# Altium project lan9252.PrjPcb
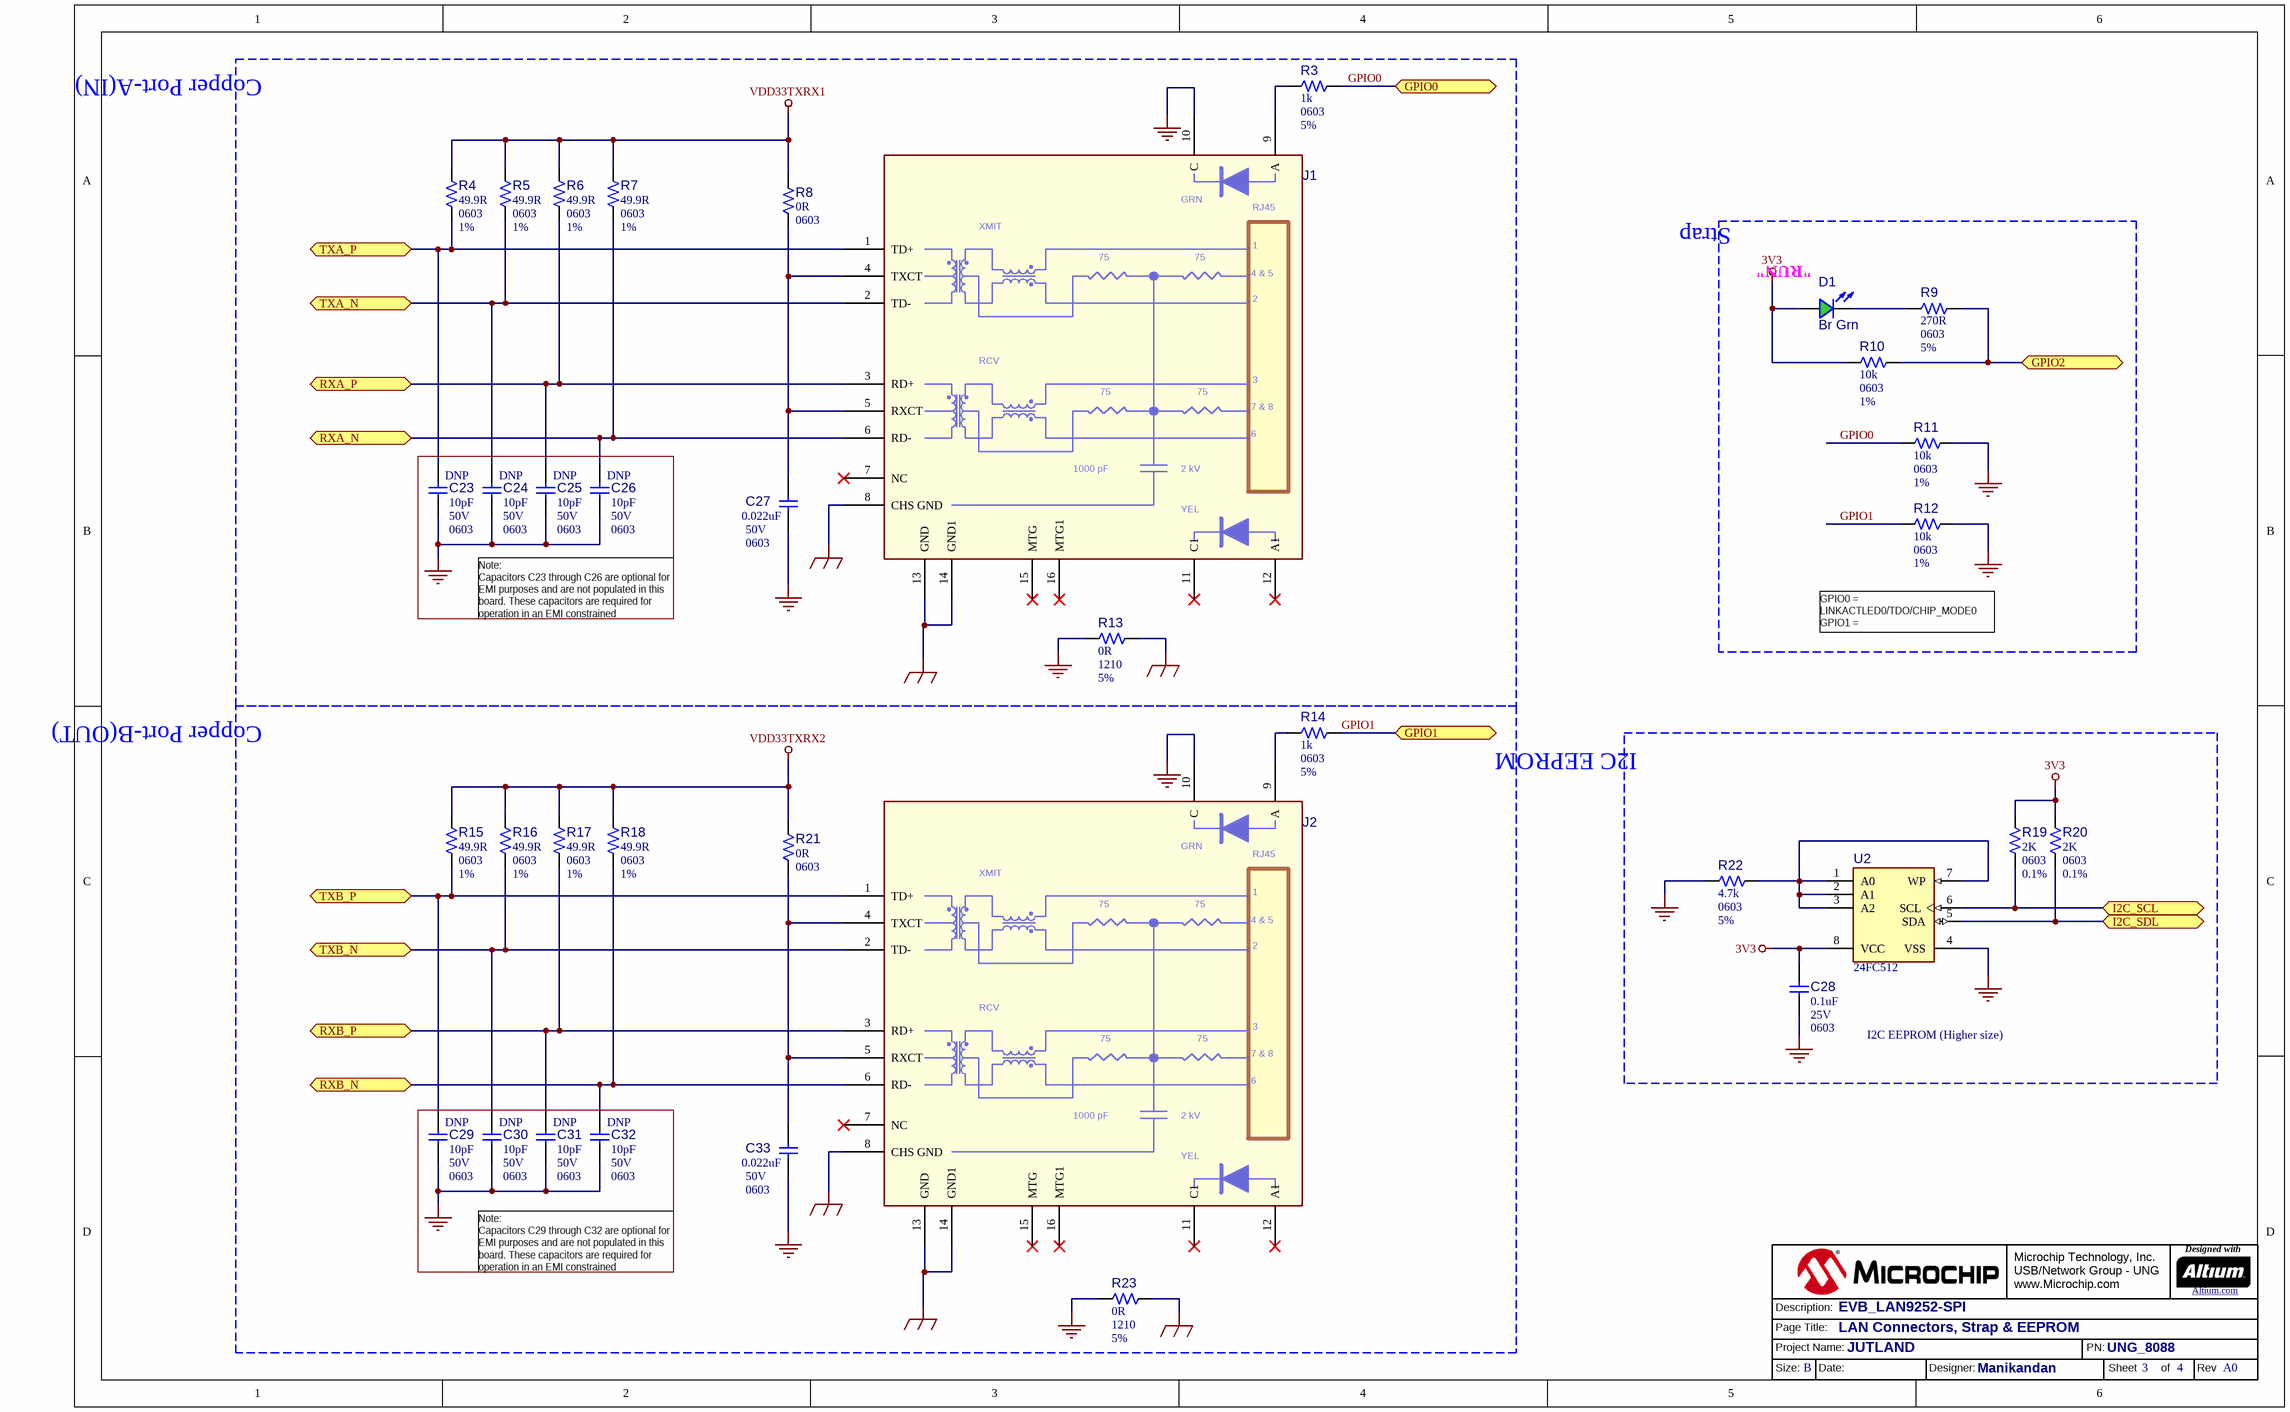
[diagram p0: UNG_8088_EVB_LAN9252-SPI_Copper.SchDoc]
3 sheets, 86 parts. Net scope: flat (ports and power ports of the same name join across sheets).
Board file: UNG_8088_EVB_LAN9252-SPI.PcbDoc
Sheets:
  UNG_8088_EVB_LAN9252-SPI_Copper.SchDoc
  UNG_8088_EVB_LAN9252-SPI_LAN9252-1.SchDoc
  UNG_8088_EVB_LAN9252-SPI_LAN9252-2.SchDoc

## Sheet UNG_8088_EVB_LAN9252-SPI_Copper.SchDoc
size 416 x 264 mm; Revision: A0; SheetNumber: 3; SheetTotal: 4; PageSetup: Record=PageOptions|CenterHorizontal=True|CenterVertical=True|PrintScale=1.02|XCorrection=1.00|YCorrection=1.00|PrintKind=0|BorderSize=5000000|LeftOffset=0|BottomOffset=0|Orientation=2|PaperLength=1000|PaperWidth=1000|Scale=100|PaperSource=15|PrintQuality=-3|MediaType=1|DitherType=10|PrintScaleMode=1|PaperKind=11 x 17|PaperIndex=119; SheetTitle: Change Log; PageTitle: LAN Connectors, Strap & EEPROM; ProjName: JUTLAND; DesignDescription: EVB_LAN9252-SPI; Designer: Manikandan; PartNumber: UNG_8088; DocumentFullPathAndName: //depot_np_hweng_boards/ung_hweng/UNG_8088_FDB_LAN9252-ADD-ON-forF28379D/

### Parts
(Parts that share a designator on the sheet are numbered #1, #2 ... from top to bottom, then left to right.)
?#1  (no value)  (graphical)
C23  value 10pF  Voltage: 50V  Package: 0603  Populated: DNP  [CAP_C_0603]  (hidden comment: Capacitor NP)
C24  value 10pF  Voltage: 50V  Package: 0603  Populated: DNP  [CAP_C_0603]  (hidden comment: Capacitor NP)
C25  value 10pF  Voltage: 50V  Package: 0603  Populated: DNP  [CAP_C_0603]  (hidden comment: Capacitor NP)
C26  value 10pF  Voltage: 50V  Package: 0603  Populated: DNP  [CAP_C_0603]  (hidden comment: Capacitor NP)
C27  value 0.022uF  Voltage: 50V  Package: 0603  [CAP_C_0603]  (hidden comment: Capacitor NP)
C28  value 0.1uF  Voltage: 25V  Package: 0603  [CAP_C_0603]  (hidden comment: Capacitor NP)
C29  value 10pF  Voltage: 50V  Package: 0603  Populated: DNP  [CAP_C_0603]  (hidden comment: Capacitor NP)
C30  value 10pF  Voltage: 50V  Package: 0603  Populated: DNP  [CAP_C_0603]  (hidden comment: Capacitor NP)
C31  value 10pF  Voltage: 50V  Package: 0603  Populated: DNP  [CAP_C_0603]  (hidden comment: Capacitor NP)
C32  value 10pF  Voltage: 50V  Package: 0603  Populated: DNP  [CAP_C_0603]  (hidden comment: Capacitor NP)
C33  value 0.022uF  Voltage: 50V  Package: 0603  [CAP_C_0603]  (hidden comment: Capacitor NP)
D1  value Br Grn  [LED_0603_GREEN]  (hidden comment: LED, Bright Green, 0603)
J1  CONN RJ45 J0011D01BNL  [RJ45_J0011D01BNL]  (value not drawn)
J2  CONN RJ45 J0011D01BNL  [RJ45_J0011D01BNL]  (value not drawn)
R3  value 1k  Package: 0603  Tolerance: 5%  [RES_C_0603]  (hidden comment: Resistor)
R4  value 49.9R  Package: 0603  Tolerance: 1%  [RES_C_0603]  (hidden comment: Resistor)
R5  value 49.9R  Package: 0603  Tolerance: 1%  [RES_C_0603]  (hidden comment: Resistor)
R6  value 49.9R  Package: 0603  Tolerance: 1%  [RES_C_0603]  (hidden comment: Resistor)
R7  value 49.9R  Package: 0603  Tolerance: 1%  [RES_C_0603]  (hidden comment: Resistor)
R8  value 0R  Package: 0603  [RES_C_0603]  (hidden comment: Resistor)
R9  value 270R  Package: 0603  Tolerance: 5%  [RES_C_0603]  (hidden comment: Resistor)
R10  value 10k  Package: 0603  Tolerance: 1%  [RES_C_0603]  (hidden comment: Resistor)
R11  value 10k  Package: 0603  Tolerance: 1%  [RES_C_0603]  (hidden comment: Resistor)
R12  value 10k  Package: 0603  Tolerance: 1%  [RES_C_0603]  (hidden comment: Resistor)
R13  value 0R  Package: 1210  Tolerance: 5%  [RES_C_1210]  (hidden comment: Resistor)
R14  value 1k  Package: 0603  Tolerance: 5%  [RES_C_0603]  (hidden comment: Resistor)
R15  value 49.9R  Package: 0603  Tolerance: 1%  [RES_C_0603]  (hidden comment: Resistor)
R16  value 49.9R  Package: 0603  Tolerance: 1%  [RES_C_0603]  (hidden comment: Resistor)
R17  value 49.9R  Package: 0603  Tolerance: 1%  [RES_C_0603]  (hidden comment: Resistor)
R18  value 49.9R  Package: 0603  Tolerance: 1%  [RES_C_0603]  (hidden comment: Resistor)
R19  value 2K  Package: 0603  Tolerance: 0.1%  [RES_C_0603]  (hidden comment: Resistor)
R20  value 2K  Package: 0603  Tolerance: 0.1%  [RES_C_0603]  (hidden comment: Resistor)
R21  value 0R  Package: 0603  [RES_C_0603]  (hidden comment: Resistor)
R22  value 4.7k  Package: 0603  Tolerance: 5%  [RES_C_0603]  (hidden comment: Resistor)
R23  value 0R  Package: 1210  Tolerance: 5%  [RES_C_1210]  (hidden comment: Resistor)
U2  24FC512  [SOIC-8]

### Blocks framed on the sheet
Copper Port-A(IN): C23-C27 J1 R3-R8 R13
Strap: D1 R9-R12
Copper Port-B(OUT): C29-C33 J2 R14-R18 R21 R23
I2C EEPROM: C28 R19 R20 R22 U2

### Ports
GPIO0 (bidir), GPIO1 (bidir), GPIO2 (bidir), I2C_SCL (bidir), I2C_SDL (bidir), RXA_N (bidir), RXA_P (bidir), RXB_N (bidir), RXB_P (bidir), TXA_N (bidir), TXA_P (bidir), TXB_N (bidir), TXB_P (bidir)

### Nets
3V3: C28.2 D1.1(A) R10.2 R19.2 R20.2 U2.8(VCC)
Earth1: J1.8(CHS_GND) J1.13(GND) J1.14(GND1) R13.2
Earth2: J2.8(CHS_GND) J2.13(GND) J2.14(GND1) R23.2
GND: C23.1 C24.1 C25.1 C26.1 C27.1 C28.1 C29.1 C30.1 C31.1 C32.1 C33.1 J1.10(C) J2.10(C) R11.1 R12.1 R13.1 R22.1 R23.1 U2.4(VSS)
VDD33TXRX1: R4.2 R5.2 R6.2 R7.2 R8.2
VDD33TXRX2: R15.2 R16.2 R17.2 R18.2 R21.2
GPIO0: R3.2 R11.2 ; port GPIO0
GPIO1: R12.2 R14.2 ; port GPIO1
NetC23_2: C23.2 J1.1(TD+) R4.1 ; port TXA_P
NetC24_2: C24.2 J1.2(TD-) R5.1 ; port TXA_N
NetC25_2: C25.2 J1.3(RD+) R6.1 ; port RXA_P
NetC26_2: C26.2 J1.6(RD-) R7.1 ; port RXA_N
NetC27_2: C27.2 J1.4(TXCT) J1.5(RXCT) R8.1
NetC29_2: C29.2 J2.1(TD+) R15.1 ; port TXB_P
NetC30_2: C30.2 J2.2(TD-) R16.1 ; port TXB_N
NetC31_2: C31.2 J2.3(RD+) R17.1 ; port RXB_P
NetC32_2: C32.2 J2.6(RD-) R18.1 ; port RXB_N
NetC33_2: C33.2 J2.4(TXCT) J2.5(RXCT) R21.1
NetD1_2: D1.2(K) R9.2
NetJ1_9: J1.9(A) R3.1
NetJ2_9: J2.9(A) R14.1
NetR9_1: R9.1 R10.1 ; port GPIO2
NetR19_1: R19.1 U2.6(SCL) ; port I2C_SCL
NetR20_1: R20.1 U2.5(SDA) ; port I2C_SDL
NetR22_2: R22.2 U2.1(A0) U2.2(A1) U2.3(A2) U2.7(WP)

Not connected (* = marked no-connect by the designer): J1 7(NC)* 11(C1)* 12(A1)* 15(MTG)* 16(MTG1)*; J2 7(NC)* 11(C1)* 12(A1)* 15(MTG)* 16(MTG1)*

### Notes on the sheet
- (near D1) "RUN"
- Note:
  Capacitors C23 through C26 are optional for EMI purposes and are not populated in this  board. These capacitors are required for operation in an EMI constrained environment.
- GPIO0 = LINKACTLED0/TDO/CHIP_MODE0
  GPIO1 = LINKACTLED1/TDI/CHIP_MODE1
  GPIO2 = RUNLED/E2PSIZE
- I2C EEPROM (Higher size)
- Note:
  Capacitors C29 through C32 are optional for EMI purposes and are not populated in this  board. These capacitors are required for operation in an EMI constrained environment.
- Microchip Technology, Inc.
  USB/Network Group - UNG
  www.Microchip.com
- Designed with
- Altium.com <http://go.altium.com/MicrochipLandingPage_Evaluation.html>
- Page Title:
- Project Name:
- Description:
- PN:
- Size:
- B
- Date:
- Designer:
- Sheet
- of
- Rev
- (in symbol CONN RJ45 TH PULSE J0011D01BNL) GRN; XMIT; 75; 4 & 5; RCV; 7 & 8; 1000 pF; 2 kV; YEL

### Library data of the parts
?#1 = Title Block B_UNG1_Altium
C23-C26 C29-C32 = CAP0142: Capacitor; Manufacturer 1: KEMET; Manufacturer Part Number 1: C0603C100J5GAC; Description_: CAP CER 10pF 50V 5% NP0 SMD 0603; Tolerance: 5%; Temperature Coeffcient: NP0; Type: Ceramic; MCHP-ID: CAP0142; Revision: 1; Status: Production; ComponentLink1URL: https://chn-vm-apps.microchip.com/mchprepo/parts/Datasheets/KEM_C1002_X7R_SMD.pdf; ComponentLink1Description: Datasheet; Operating Temperature: -55C to +125C; Category: Capacitor; Manufacturer 2: KEMET; Manufacturer Part Number 2: C0603C100J5GACTU; Manufacturer 3: TDK; Manufacturer Part Number 3: C1608C0G1H100J; Manufacturer 4: Murata; Manufacturer Part Number 4: GRM1885C1H100JA01D; Supplier 1: KEMET; Supplier Part Number 1: C0603C100J5GAC; Supplier 2: Digi-Key; Supplier Part Number 2: 399-1049-2-ND; Supplier 3: Digi-Key; Supplier Part Number 3: 445-6852-1-ND; Supplier 4: Digi-Key; Supplier Part Number 4: 490-1403-2-ND; Supplier 5: Digi-Key; Supplier Part Number 5: 490-1403-1-ND; Quantity Override: 1
C27 C33 = CAP0625: Capacitor; Manufacturer 1: AVX; Manufacturer Part Number 1: 06035C223JAT2A; Description_: CAP CER 0.022uF 50V 5% X7R SMD 0603; Tolerance: 5%; Temperature Coeffcient: X7R; Type: Ceramic; Populated: YES; MCHP-ID: CAP0625; Revision: 1; Status: Production; ComponentLink1URL: https://chn-vm-apps.microchip.com/mchprepo/parts/Datasheets/smccp.pdf; ComponentLink1Description: Datasheet; Operating Temperature: -55C to +125C; Category: Capacitor; Supplier 1: Digi-Key; Supplier Part Number 1: 478-3722-2-ND; Quantity Override: 1
C28 = CAP0012: Capacitor; Manufacturer 1: Cal-Chip; Manufacturer Part Number 1: GMC10Y5V104Z25NTLF; Description_: CAP CER 0.1uF 25V 20% Y5V SMD 0603; Tolerance: 20%; Temperature Coeffcient: Y5V; Type: Ceramic; Populated: Yes; MCHP-ID: CAP0012; Revision: 1; Status: Production; ComponentLink1URL: https://chn-vm-apps.microchip.com/mchprepo/parts/Datasheets/nmc2.pdf; ComponentLink1Description: Datasheet; Operating Temperature: -30C to + 85C; Category: Capacitor; Manufacturer 2: NIC Components; Manufacturer Part Number 2: NMC0603Y5V104Z25TRPF; Manufacturer 3: Panasonic; Manufacturer Part Number 3: ECJ-1VF1E104Z; Manufacturer 4: ROHM; Manufacturer Part Number 4: MCH182FN104ZK; Manufacturer 5: Murata; Manufacturer Part Number 5: GRM188F51E104ZA01D; Supplier 1: Cal-Chip; Supplier Part Number 1: GMC10Y5V104Z25NTLF; Supplier 2: NIC Components; Supplier Part Number 2: NMC0603Y5V104Z25TRPF; Supplier 3: Digi-Key; Supplier Part Number 3: PCC1794TR-ND; Supplier 4: ROHM; Supplier Part Number 4: MCH182FN104ZK; Supplier 5: Raynen; Supplier Part Number 5: 490-1575-1-ND; Quantity Override: 1
D1 = LED, Bright Green, 0603: Manufacturer 1: Lite-On; Manufacturer Part Number 1: LTST-C191KGKT; Type: LED Single; Forward Current: 20mA; MCD: 35mcd; Owner: Jennifer Hancock; Viewing Angle: 130°; Revision: -; Description_: LED, Bright Green, 0603; Package: 0603 (1608 Metric); ComponentLink1URL: http://optoelectronics.liteon.com/upload/download/DS22-2000-228/S_110_LTST-C191KGKT.pdf; ComponentLink1Description: Datasheet; Category: Diode; Mounting Type: Surface Mount; Supplier 1: Digi-Key; Supplier Part Number 1: 160-1446-6-ND
J1 J2 = CONN RJ45 TH PULSE J0011D01BNL: Owner: Manikandan; Populated: YES; Description_: CONN RJ45 TH PULSE J0011D01BNL; ComponentLink1URL: http://www.digikey.com/product-search/en?keywords=J0011D01BNL; ComponentLink1Description: Datasheet; Package: RJ45; Type: Connector; Category: Interconnects; Manufacturer 1: Pulse; Manufacturer Part Number 1: J0011D01BNL; Supplier 1: Digi-Key; Supplier Part Number 1: 553-1483-ND; ROHS: Yes
R3 R14 = RES1128: Manufacturer 1: Panasonic; Manufacturer Part Number 1: ERJ-3GEYJ102V; Description_: RES TKF 1k 5% 1/10W SMD 0603; Voltage: 75V; Temperature Coeffcient: 200ppm/C; Power: 1/10W; Owner: Bogdan P (M91398); Populated: Yes; MCHP-ID: RES1128; Revision: 0; Status: Production; ComponentLink1URL: https://chn-vm-apps.microchip.com/mchprepo/parts/Datasheets/AOA0000CE1.pdf; ComponentLink1Description: Datasheet; Operating Temperature: -55C to +155C; Category: Resistor; Type: RES SMD; Composition: TKF; Supplier 1: Digi-Key; Supplier Part Number 1: P1.0KGCT-ND; Quantity Override: 1
R4-R7 R15-R18 = RES1188: Manufacturer 1: Panasonic; Manufacturer Part Number 1: ERJ-3EKF49R9V; Description_: RES TKF 49.9R 1% 1/10W SMD 0603; Voltage: 75V; Temperature Coeffcient: 100ppm/C; Power: 1/10W; Owner: Adrian T (M91397); Populated: Yes; MCHP-ID: RES1188; Revision: 0; Status: Production; ComponentLink1URL: https://chn-vm-apps.microchip.com/mchprepo/parts/Datasheets/AOA0000CE2.pdf; ComponentLink1Description: Datasheet; Operating Temperature: -55C to +155C; Category: Resistor; Type: RES SMD; Composition: TKF; Supplier 1: Digi-Key; Supplier Part Number 1: P49.9HCT-ND; Quantity Override: 1
R8 R21 = RSMT0001: Manufacturer 1: NIC Components; Manufacturer Part Number 1: NRC06Z0TRF; Description_: RES TKF 0R 1/10W SMD 0603; Power: 1/10W; Populated: Yes; MCHP-ID: RSMT0001; Revision: 2; Status: Production; ComponentLink1URL: https://chn-vm-apps.microchip.com/mchprepo/parts/Datasheets/nrc.pdf; ComponentLink1Description: Datasheet; Operating Temperature: -55C to +155C; Category: Resistor; Type: RES SMD; Composition: TKF; Manufacturer 2: Panasonic; Manufacturer Part Number 2: ERJ-3GSY0R00V; Manufacturer 3: Panasonic; Manufacturer Part Number 3: ERJ-3GEY0R00V; Manufacturer 4: Stackpole Electronics Inc; Manufacturer Part Number 4: RMCF0603ZT0R00; Manufacturer 5: Vishay; Manufacturer Part Number 5: CRCW06030000Z0EA; Manufacturer 6: Stackpole Electronics Inc; Manufacturer Part Number 6: RMCF 1/16 0 R; Manufacturer 7: Yageo; Manufacturer Part Number 7: RC0603JR-070RL; Manufacturer 8: KOA Speer; Manufacturer Part Number 8: RK73Z1JTTP; Manufacturer 9: ROHM; Manufacturer Part Number 9: MCR03EZPJ000; Supplier 1: NIC Components; Supplier Part Number 1: NRC06Z0TRF; Supplier 2: Digi-Key; Supplier Part Number 2: P0.0GTR-ND; Supplier 3: Digi-Key; Supplier Part Number 3: RMCF0603ZT0R00TR-ND; Supplier 4: Digi-Key; Supplier Part Number 4: RMCF0603ZT0R00CT-ND; Supplier 5: Digi-Key; Supplier Part Number 5: 541-0.0GCT-ND; Supplier 6: Digi-Key; Supplier Part Number 6: RMCF1/160RTR-ND; Supplier 7: Digi-Key; Supplier Part Number 7: 311-0.0GRCT-ND; Supplier 8: KOA Speer; Supplier Part Number 8: RK73Z1JTTP; Supplier 9: Digi-Key; Supplier Part Number 9: RHM0.0GCT-ND; Quantity Override: 1
R9 = RES1150: Manufacturer 1: Panasonic; Manufacturer Part Number 1: ERJ-3GEYJ271V; Description_: RES TKF 270R 5% 1/10W SMD 0603; Dev Tools Status: Production; Voltage: 75V; Temperature Coeffcient: 200ppm/C; Power: 1/10W; Owner: Bogdan P (M91398); Populated: Yes; MCHP-ID: RES1150; Revision: 0; Status: MCL Design; ComponentLink1URL: https://chn-vm-apps.microchip.com/mchprepo/parts/Datasheets/AOA0000CE1.pdf; ComponentLink1Description: Datasheet; Operating Temperature: -55C to +155C; Category: Resistor; Type: RES SMD; Composition: TKF; Supplier 1: Digi-Key; Supplier Part Number 1: P270GCT-ND; Quantity Override: 1
R10-R12 = RES1368: Manufacturer 1: TE Connectivity; Manufacturer Part Number 1: 5-1879337-9; Description_: RES TF 10k 1% 1/16W SMD 0603; Voltage: 100V; Temperature Coeffcient: 50ppm/C; Circuit Type: Isolated; Power: 1/16W; Owner: Jairuz Agang-ang; Populated: YES; MCHP-ID: RES1368; Revision: 1; Status: Production; ComponentLink1URL: https://chn-vm-apps.microchip.com/mchprepo/parts/Datasheets/ENG_DS_1773200_H.pdf; ComponentLink1Description: Datasheet; Operating Temperature: -55C to +155C; Category: Resistor; Type: RES SMD; Composition: TF; Supplier 1: Digi-Key; Supplier Part Number 1: A102203CT-ND; Quantity Override: 1
R13 R23 = RSMT0610: Manufacturer 1: Vishay; Manufacturer Part Number 1: CRCW12100000Z0EA; Description_: RES TKF 0R 1/3W SMD 1210; Power: 1/3W; Populated: Yes; MCHP-ID: RSMT0610; Revision: 1; Status: Production; ComponentLink1URL: https://chn-vm-apps.microchip.com/mchprepo/parts/Datasheets/dcrcwe3.pdf; ComponentLink1Description: Datasheet; Operating Temperature: -55C to +155C; Category: Resistor; Type: RES SMD; Composition: TKF; Supplier 1: Digi-Key; Supplier Part Number 1: 541-0.0VCT-ND; Quantity Override: 1
R19 R20 = RES1693: Manufacturer 1: Yageo; Manufacturer Part Number 1: RT0603BRD072KL; Description_: RES SMD 2K OHM 0.1% 1/10W 0603; Dev Tools Status: Design; Temperature Coeffcient: ±25ppm/°C; Power: 0.1W, 1/10W; Owner: Jose Garcia; Populated: YES; MCHP-ID: RES1693; Revision: 1; Symbol: Resistor; Status: MCL Design; ComponentLink1Description: Datasheet; Operating Temperature: -55°C ~ 155°C; Category: Resistor; Type: RES SMD; Composition: TF; Supplier 1: Digi-Key; Supplier Part Number 1: YAG1626CT-ND; Quantity Override: 1
R22 = RES1178: Manufacturer 1: Panasonic; Manufacturer Part Number 1: ERJ-3GEYJ472V; Description_: RES TKF 4.7k 5% 1/10W SMD 0603; Dev Tools Status: Production; Voltage: 75V; Temperature Coeffcient: 200ppm/C; Power: 1/10W; Owner: Bogdan P (M91398); Populated: Yes; MCHP-ID: RES1178; Revision: 0; Symbol: Resistor; Status: MCL Design; ComponentLink1URL: https://chn-vm-apps.microchip.com/mchprepo/parts/Datasheets/AOA0000CE1.pdf; ComponentLink1Description: Datasheet; Operating Temperature: -55C to +155C; Category: Resistor; Type: RES SMD; Composition: TKF; Supplier 1: Digi-Key; Supplier Part Number 1: P4.7KGCT-ND; Quantity Override: 1
U2 = 24FC512: EEPROM I2C; Manufacturer 1: Microchip; Manufacturer Part Number 1: 24FC512T-I/SN; Description_: MCHP MEMORY SERIAL EEPROM 512k I2C 24FC512-I/SN SOIC-8; Symobl: 24XXXX SOIC-8; MAPS Description: 512K, 64K X 8 2.5V SERIAL EE, IND; Dev Tools Status: Production; PackingMedia: T/R; TempRange: -40C to +85C; LeadCount: 8; PackageWidth: 3.90mm(.150in); LeadContent: Pb-FREE; MemorySizeNum: 512000; OpVoltMin: 2.5; OpVoltMax: 5.5; MaxClockFreq: 400 kHz; AddressPins: 3; WPScheme: Full Array; MemoryOrg: x8; Populated: Yes; Type: Serial EEPROM; Category: MCHP-Memory; ComponentLink1URL: http://www.microchip.com/wwwproducts/en/24FC512; ComponentLink1Description: Datasheet; Manufacturer 2: Microchip; Manufacturer Part Number 2: 24FC512-I/SN; Supplier 1: Microchip; Supplier Part Number 1: 24FC512T-I/SN; Supplier 2: Microchip; Supplier Part Number 2: 24FC512-I/SN; PackageType: SOIC; Quantity Override: 1; Value: 24FC512

## Sheet UNG_8088_EVB_LAN9252-SPI_LAN9252-1.SchDoc
size 416 x 264 mm; Revision: A0; SheetNumber: 2; SheetTotal: 4; PageSetup: Record=PageOptions|CenterHorizontal=True|CenterVertical=True|PrintScale=1.02|XCorrection=1.00|YCorrection=1.00|PrintKind=0|BorderSize=5000000|LeftOffset=0|BottomOffset=0|Orientation=2|PaperLength=1000|PaperWidth=1000|Scale=100|PaperSource=15|PrintQuality=-3|MediaType=1|DitherType=10|PrintScaleMode=1|PaperKind=11 x 17|PaperIndex=119; SheetTitle: Change Log; PageTitle: LAN9252-1; ProjName: JUTLAND; DesignDescription: EVB_LAN9252-SPI; Designer: Manikandan; PartNumber: UNG_8088; DocumentFullPathAndName: //depot_np_hweng_boards/ung_hweng/UNG_8088_FDB_LAN9252-ADD-ON-forF28379D/
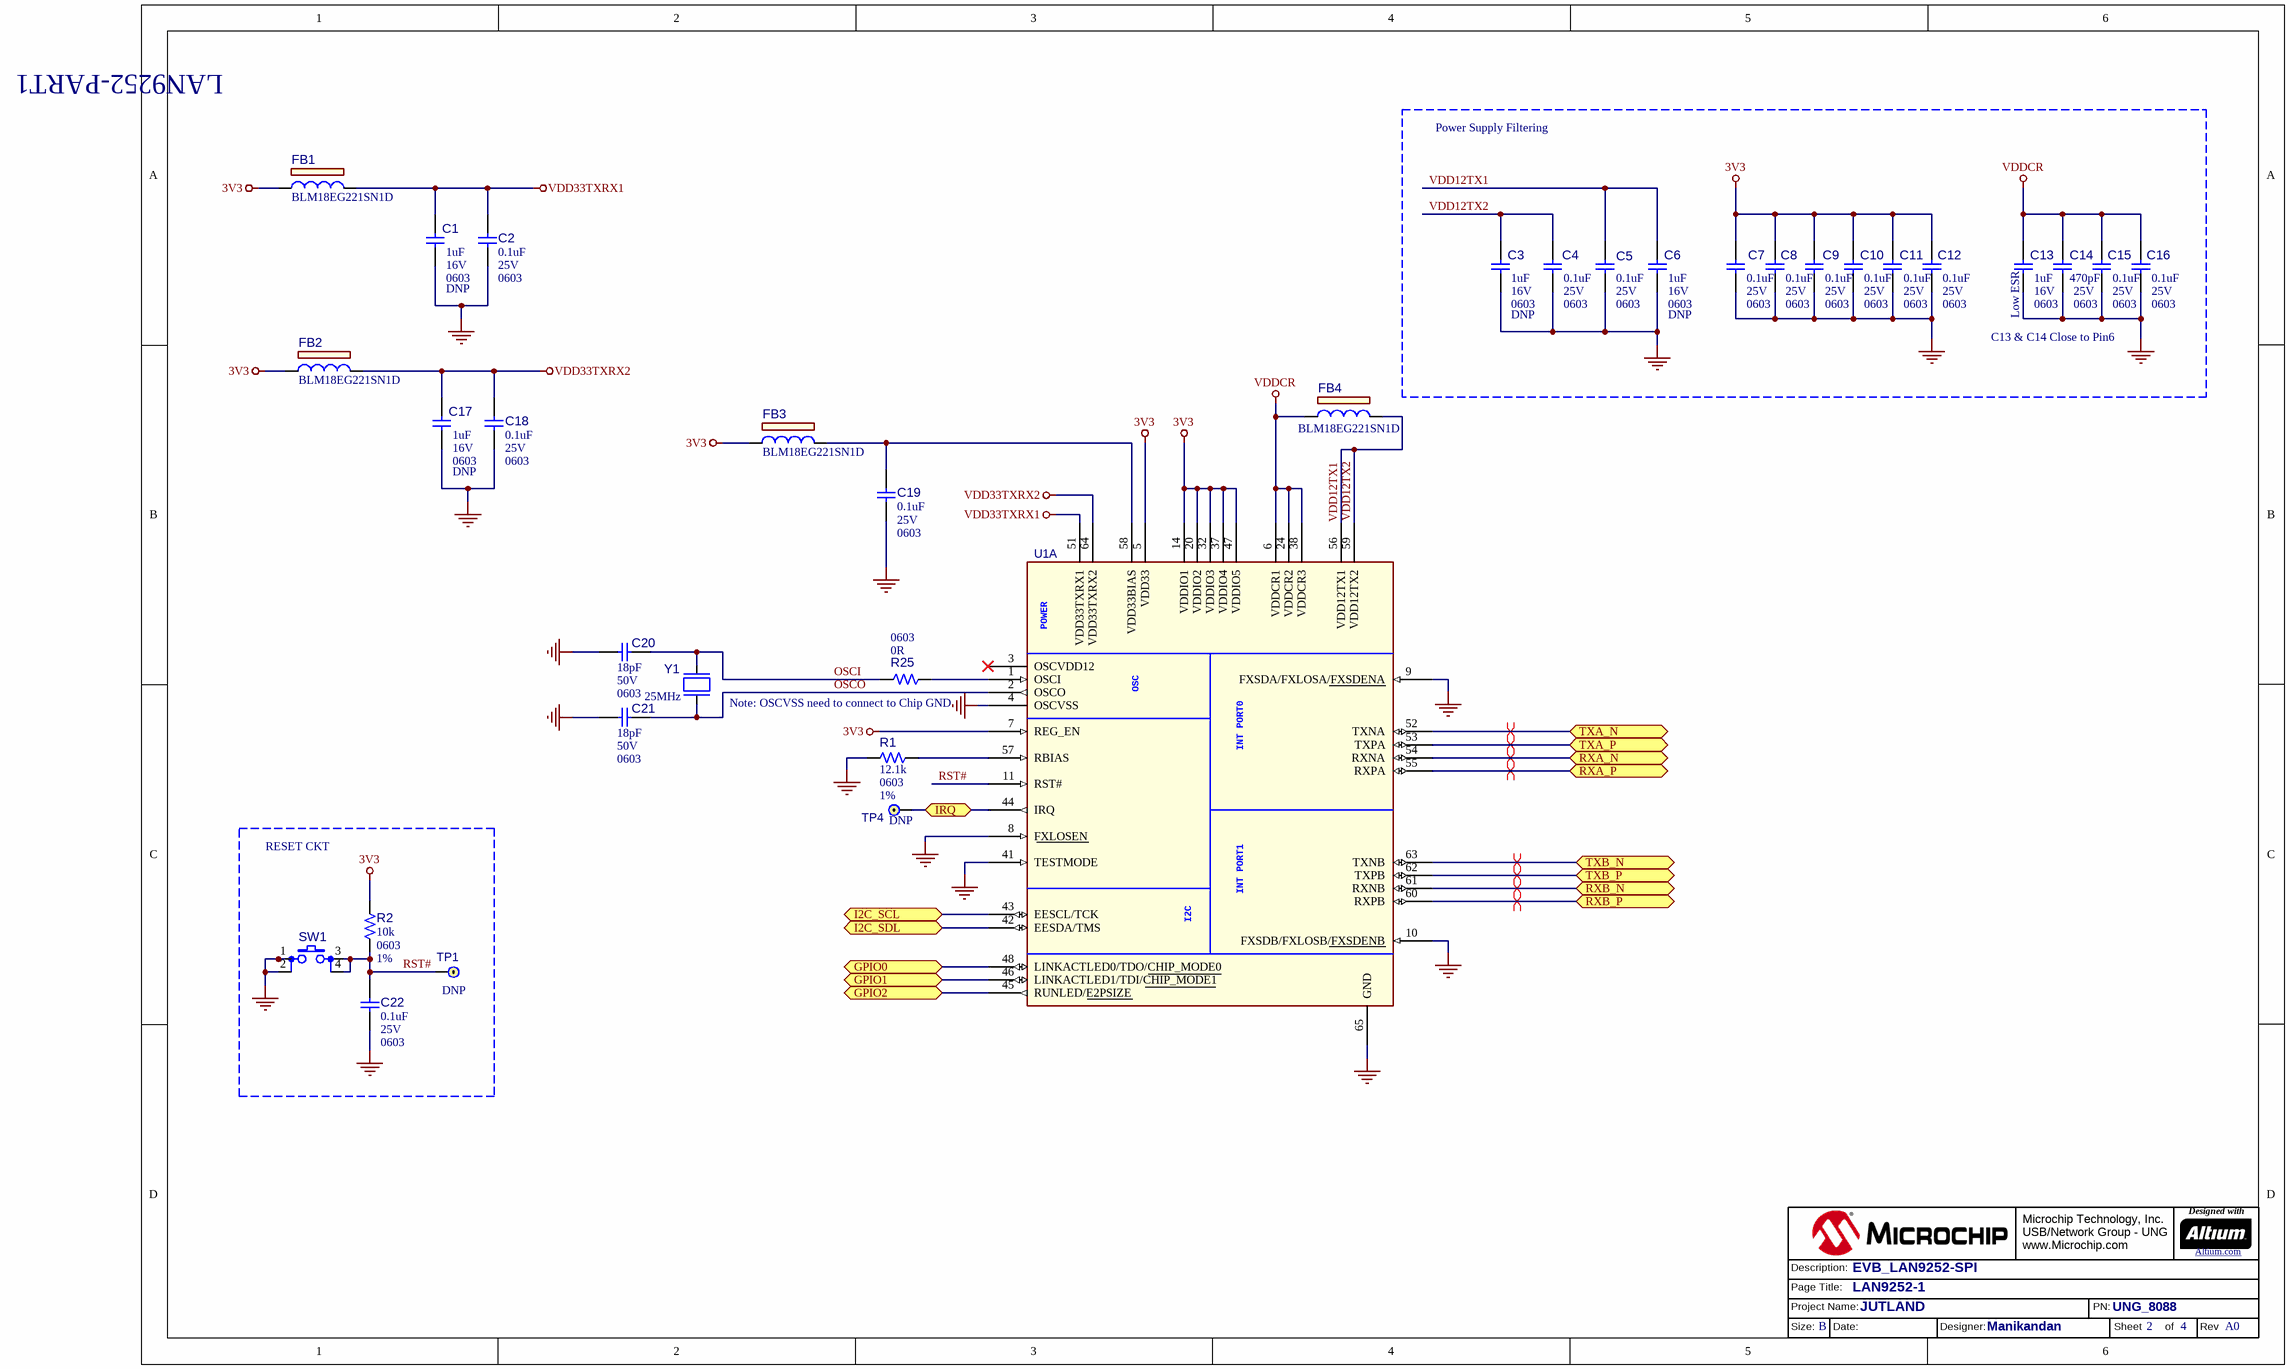
[diagram p1: UNG_8088_EVB_LAN9252-SPI_LAN9252-1.SchDoc]

### Parts
(Parts that share a designator on the sheet are numbered #1, #2 ... from top to bottom, then left to right.)
?#2  (no value)  (graphical)
C1  value 1uF  Voltage: 16V  Package: 0603  Populated: DNP  [CAP_C_0603]  (hidden comment: Capacitor NP)
C2  value 0.1uF  Voltage: 25V  Package: 0603  [CAP_C_0603]  (hidden comment: Capacitor NP)
C3  value 1uF  Voltage: 16V  Package: 0603  Populated: DNP  [CAP_C_0603]  (hidden comment: Capacitor NP)
C4  value 0.1uF  Voltage: 25V  Package: 0603  [CAP_C_0603]  (hidden comment: Capacitor NP)
C5  value 0.1uF  Voltage: 25V  Package: 0603  [CAP_C_0603]  (hidden comment: Capacitor NP)
C6  value 1uF  Voltage: 16V  Package: 0603  Populated: DNP  [CAP_C_0603]  (hidden comment: Capacitor NP)
C7  value 0.1uF  Voltage: 25V  Package: 0603  [CAP_C_0603]  (hidden comment: Capacitor NP)
C8  value 0.1uF  Voltage: 25V  Package: 0603  [CAP_C_0603]  (hidden comment: Capacitor NP)
C9  value 0.1uF  Voltage: 25V  Package: 0603  [CAP_C_0603]  (hidden comment: Capacitor NP)
C10  value 0.1uF  Voltage: 25V  Package: 0603  [CAP_C_0603]  (hidden comment: Capacitor NP)
C11  value 0.1uF  Voltage: 25V  Package: 0603  [CAP_C_0603]  (hidden comment: Capacitor NP)
C12  value 0.1uF  Voltage: 25V  Package: 0603  [CAP_C_0603]  (hidden comment: Capacitor NP)
C13  value 1uF  Voltage: 16V  Package: 0603  [CAP_C_0603]  (hidden comment: Capacitor NP)
C14  value 470pF  Voltage: 25V  Package: 0603  [CAP_C_0603]  (hidden comment: Capacitor NP)
C15  value 0.1uF  Voltage: 25V  Package: 0603  [CAP_C_0603]  (hidden comment: Capacitor NP)
C16  value 0.1uF  Voltage: 25V  Package: 0603  [CAP_C_0603]  (hidden comment: Capacitor NP)
C17  value 1uF  Voltage: 16V  Package: 0603  Populated: DNP  [CAP_C_0603]  (hidden comment: Capacitor NP)
C18  value 0.1uF  Voltage: 25V  Package: 0603  [CAP_C_0603]  (hidden comment: Capacitor NP)
C19  value 0.1uF  Voltage: 25V  Package: 0603  [CAP_C_0603]  (hidden comment: Capacitor NP)
C20  value 18pF  Voltage: 50V  Package: 0603  [CAP_C_0603]  (hidden comment: Capacitor NP)
C21  value 18pF  Voltage: 50V  Package: 0603  [CAP_C_0603]  (hidden comment: Capacitor NP)
C22  value 0.1uF  Voltage: 25V  Package: 0603  [CAP_C_0603]  (hidden comment: Capacitor NP)
FB1  value BLM18EG221SN1D  [SMD_0603]  (hidden comment: FERRITE BLM18EG221SN1D)
FB2  value BLM18EG221SN1D  [SMD_0603]  (hidden comment: FERRITE BLM18EG221SN1D)
FB3  value BLM18EG221SN1D  [SMD_0603]  (hidden comment: FERRITE BLM18EG221SN1D)
FB4  value BLM18EG221SN1D  [SMD_0603]  (hidden comment: FERRITE BLM18EG221SN1D)
R1  value 12.1k  Package: 0603  Tolerance: 1%  [RES_C_0603]  (hidden comment: Resistor)
R2  value 10k  Package: 0603  Tolerance: 1%  [RES_C_0603]  (hidden comment: Resistor)
R25  value 0R  Package: 0603  [RES_C_0603]  (hidden comment: Resistor)
SW1  Switch TACT 4 Pin PTS810  [SW_MOM_4M2X3M2]  (value not drawn)
TP1  Populated: DNP  [TP_PAD51D36]  (hidden comment: Jumper)  (no BOM)
TP4  Populated: DNP  [TP_PAD51D36]  (hidden comment: Jumper)  (no BOM)
U1  (no value)  [QFN-64_9x9_EP6SQ]  (part A of 2)
Y1  Frequency: 25MHz  [CRYSTAL_HC49-SMD-B]  (hidden comment: XTAL 25MHz HC49/US)

### Blocks framed on the sheet
RESET CKT: C22 R2 SW1 TP1

### Ports
GPIO0 (bidir), GPIO1 (bidir), GPIO2 (bidir), I2C_SCL (bidir), I2C_SDL (bidir), IRQ (bidir), RXA_N (bidir), RXA_P (bidir), RXB_N (bidir), RXB_P (bidir), TXA_N (bidir), TXA_P (bidir), TXB_N (bidir), TXB_P (bidir)

### Nets
3V3: C7.2 C8.2 C9.2 C10.2 C11.2 C12.2 FB1.1 FB2.1 FB3.1 R2.2 U1.5(VDD33) U1.7(REG_EN) U1.14(VDDIO1) U1.20(VDDIO2) U1.32(VDDIO3) U1.37(VDDIO4) U1.47(VDDIO5)
GND: C1.1 C2.1 C3.1 C4.1 C5.1 C6.1 C7.1 C8.1 C9.1 C10.1 C11.1 C12.1 C13.1 C14.1 C15.1 C16.1 C17.1 C18.1 C19.1 C20.1 C21.1 C22.1 R1.1 SW1.1 SW1.2 U1.4(OSCVSS) U1.8(FXLOSEN) U1.9(FXSDA/FXLOSA/FXSDENA) U1.10(FXSDB/FXLOSB/FXSDENB) U1.41(TESTMODE) U1.65(GND)
VDD33TXRX1: C1.2 C2.2 FB1.2 U1.51(VDD33TXRX1)
VDD33TXRX2: C17.2 C18.2 FB2.2 U1.64(VDD33TXRX2)
VDDCR: C13.2 C14.2 C15.2 C16.2 FB4.1 U1.6(VDDCR1) U1.24(VDDCR2) U1.38(VDDCR3)
GPIO0: U1.48(LINKACTLED0/TDO/CHIP_MODE0) ; port GPIO0
GPIO1: U1.46(LINKACTLED1/TDI/CHIP_MODE1) ; port GPIO1
IRQ: TP4.1(P1) U1.44(IRQ) ; port IRQ
OSCI: C20.2 R25.1 Y1.2(Osc2)
OSCO: C21.2 U1.2(OSCO) Y1.1(Osc1)
RST#: C22.2 R2.1 SW1.3 SW1.4 TP1.1(P1) U1.11(RST#)
VDD12TX1: C3.2 C4.2 C5.2 C6.2 FB4.2 U1.56(VDD12TX1) U1.59(VDD12TX2)  [also labelled VDD12TX2]
NetC19_2: C19.2 FB3.2 U1.58(VDD33BIAS)
NetC23_2: U1.53(TXPA) ; port TXA_P
NetC24_2: U1.52(TXNA) ; port TXA_N
NetC25_2: U1.55(RXPA) ; port RXA_P
NetC26_2: U1.54(RXNA) ; port RXA_N
NetC29_2: U1.62(TXPB) ; port TXB_P
NetC30_2: U1.63(TXNB) ; port TXB_N
NetC31_2: U1.60(RXPB) ; port RXB_P
NetC32_2: U1.61(RXNB) ; port RXB_N
NetR1_2: R1.2 U1.57(RBIAS)
NetR9_1: U1.45(RUNLED/E2PSIZE) ; port GPIO2
NetR19_1: U1.43(EESCL/TCK) ; port I2C_SCL
NetR20_1: U1.42(EESDA/TMS) ; port I2C_SDL
NetR25_2: R25.2 U1.1(OSCI)

Not connected (* = marked no-connect by the designer): U1 3(OSCVDD12)*

### Layout directives
differential pair: NetC23_2, NetC24_2, NetC25_2, NetC26_2, NetC29_2, NetC30_2, NetC31_2, NetC32_2

### Notes on the sheet
- LAN9252-PART1
- Power Supply Filtering
- C13 & C14 Close to Pin6
- (near C13) Low ESR
- (near R25) Note: OSCVSS need to connect to Chip GND
- Microchip Technology, Inc.
  USB/Network Group - UNG
  www.Microchip.com
- Designed with
- Altium.com <http://go.altium.com/MicrochipLandingPage_Evaluation.html>
- Page Title:
- Project Name:
- Description:
- PN:
- Size:
- B
- Date:
- Designer:
- Sheet
- of
- Rev
- (in symbol LAN9252_QFN64, part A) POWER; OSC; INT PORT0; INT PORT1; I2C

### Library data of the parts
?#2 = Title Block B_UNG1_Altium
C1 C3 C6 C17 = CAP0265: Capacitor; Manufacturer 1: AVX; Manufacturer Part Number 1: 0603YD105KAT2A; Description_: CAP CER 1uF 16V 10% X5R SMD 0603; Tolerance: 10%; Temperature Coeffcient: X5R; Type: Ceramic; MCHP-ID: CAP0265; Revision: 1; Status: Production; ComponentLink1URL: https://chn-vm-apps.microchip.com/mchprepo/parts/Datasheets/smccp.pdf; ComponentLink1Description: Datasheet; Operating Temperature: -55C to +85C; Category: Capacitor; Manufacturer 2: Murata; Manufacturer Part Number 2: GRM188R61C105KA93D; Manufacturer 3: Murata; Manufacturer Part Number 3: GRM185R61C105KE44D; Manufacturer 4: Panasonic; Manufacturer Part Number 4: ECJ-1VB1C105K; Manufacturer 5: Taiyo Yuden; Manufacturer Part Number 5: EMK107BJ105KA-T; Manufacturer 6: TDK; Manufacturer Part Number 6: C1608X5R1C105K; Supplier 1: Digi-Key; Supplier Part Number 1: 478-1249-1-ND; Supplier 2: Digi-Key; Supplier Part Number 2: 490-1536-1-ND; Supplier 3: Digi-Key; Supplier Part Number 3: 490-3894-1-ND; Supplier 4: Digi-Key; Supplier Part Number 4: PCC2224CT-ND; Supplier 5: Digi-Key; Supplier Part Number 5: 587-1251-1-ND; Supplier 6: Digi-Key; Supplier Part Number 6: 445-1416-1-ND; Quantity Override: 1
C2 C4 C5 C7-C12 C15 C16 C18 C19 C22 = CAP0012: as C28 on sheet UNG_8088_EVB_LAN9252-SPI_Copper; MCHP-ID: CAP0012; Revision: 1; Status: Production; ComponentLink1URL: https://chn-vm-apps.microchip.com/mchprepo/parts/Datasheets/nmc2.pdf; ComponentLink1Description: Datasheet; Operating Temperature: -30C to + 85C; Category: Capacitor; Manufacturer 2: NIC Components; Manufacturer Part Number 2: NMC0603Y5V104Z25TRPF; Manufacturer 3: Panasonic; Manufacturer Part Number 3: ECJ-1VF1E104Z; Manufacturer 4: ROHM; Manufacturer Part Number 4: MCH182FN104ZK; Manufacturer 5: Murata; Manufacturer Part Number 5: GRM188F51E104ZA01D; Supplier 1: Cal-Chip; Supplier Part Number 1: GMC10Y5V104Z25NTLF; Supplier 2: NIC Components; Supplier Part Number 2: NMC0603Y5V104Z25TRPF; Supplier 3: Digi-Key; Supplier Part Number 3: PCC1794TR-ND; Supplier 4: ROHM; Supplier Part Number 4: MCH182FN104ZK; Supplier 5: Raynen; Supplier Part Number 5: 490-1575-1-ND; Quantity Override: 1
C13 = CAP0265: Capacitor; Manufacturer 1: AVX; Manufacturer Part Number 1: 0603YD105KAT2A; Description_: CAP CER 1uF 16V 10% X5R SMD 0603; Tolerance: 10%; Temperature Coeffcient: X5R; Type: Ceramic; Populated: Yes; MCHP-ID: CAP0265; Revision: 1; Status: Production; ComponentLink1URL: https://chn-vm-apps.microchip.com/mchprepo/parts/Datasheets/smccp.pdf; ComponentLink1Description: Datasheet; Operating Temperature: -55C to +85C; Category: Capacitor; Manufacturer 2: Murata; Manufacturer Part Number 2: GRM188R61C105KA93D; Manufacturer 3: Murata; Manufacturer Part Number 3: GRM185R61C105KE44D; Manufacturer 4: Panasonic; Manufacturer Part Number 4: ECJ-1VB1C105K; Manufacturer 5: Taiyo Yuden; Manufacturer Part Number 5: EMK107BJ105KA-T; Manufacturer 6: TDK; Manufacturer Part Number 6: C1608X5R1C105K; Supplier 1: Digi-Key; Supplier Part Number 1: 478-1249-1-ND; Supplier 2: Digi-Key; Supplier Part Number 2: 490-1536-1-ND; Supplier 3: Digi-Key; Supplier Part Number 3: 490-3894-1-ND; Supplier 4: Digi-Key; Supplier Part Number 4: PCC2224CT-ND; Supplier 5: Digi-Key; Supplier Part Number 5: 587-1251-1-ND; Supplier 6: Digi-Key; Supplier Part Number 6: 445-1416-1-ND; Quantity Override: 1
C14 = CAP0603: Capacitor; Manufacturer 1: AVX; Manufacturer Part Number 1: 06033A471JAT2A; Description_: CAP CER 470pF 25V 5% NP0 SMD 0603; Tolerance: 5%; Temperature Coeffcient: NP0; Type: Ceramic; Populated: Yes; MCHP-ID: CAP0603; Revision: 1; Status: Production; ComponentLink1URL: https://chn-vm-apps.microchip.com/mchprepo/parts/Datasheets/smccp.pdf; ComponentLink1Description: Datasheet; Operating Temperature: -55C to +125C; Category: Capacitor; Supplier 1: Digi-Key; Supplier Part Number 1: 478-6201-1-ND; Quantity Override: 1
C20 C21 = CAP0063: Capacitor; Manufacturer 1: KEMET; Manufacturer Part Number 1: C0603C180J5GACTU; Description_: CAP CER 18pF 50V 5% NP0 SMD 0603; Tolerance: 5%; Temperature Coeffcient: NP0; Type: Ceramic; Populated: Yes; MCHP-ID: CAP0063; Revision: 1; Status: Production; ComponentLink1URL: https://chn-vm-apps.microchip.com/mchprepo/parts/Datasheets/ECJ__General_.pdf; ComponentLink1Description: Datasheet; Operating Temperature: -55C to +125C; Category: Capacitor; Manufacturer 2: TDK; Manufacturer Part Number 2: C1608C0G1H180J; Manufacturer 3: Murata; Manufacturer Part Number 3: GRM1885C1H180JA01D; Manufacturer 4: Panasonic; Manufacturer Part Number 4: ECJ-1VC1H180J; Supplier 1: Digi-Key; Supplier Part Number 1: 399-1052-1-ND; Supplier 2: Digi-Key; Supplier Part Number 2: 445-1272-1-ND; Supplier 3: Digi-Key; Supplier Part Number 3: 490-1409-1-ND; Supplier 4: Digi-Key; Supplier Part Number 4: PCC180ACVCT-ND; Quantity Override: 1
FB1-FB4 = FERRITE BLM18EG221SN1D: FERRITE BEAD 2A 220OHM 0603; Manufacturer 1: Murata Electronics North America; Owner: Manikandan; DCR: 50ohm; Populated: YES; Symbol: Ferrite Bead; Description_: FERRITE BEAD 2A 220OHM 0603; ComponentLink1URL: http://search.murata.co.jp/Ceramy/image/img/PDF/ENG/L0110S0101BLM18E.pdf; ComponentLink1Description: Datasheet; Operating Temperature: -55C to +125C; Package: 0603; Type: Ferrite Bead; Category: Ferrite Bead; Manufacturer Part Number 1: BLM18EG221SN1D; Supplier 1: Digi-Key; Supplier Part Number 1: 490-3992-1-ND; Quantity Override: 1
R1 = RSMT0414: Manufacturer 1: Panasonic; Manufacturer Part Number 1: ERJ-3EKF1212V; Description_: RES TKF 12.1k 1% 1/10W SMD 0603; Voltage: 75V; Temperature Coeffcient: 100ppm/C; Power: 1/10W; Populated: Yes; MCHP-ID: RSMT0414; Revision: 1; Status: Production; ComponentLink1URL: https://chn-vm-apps.microchip.com/mchprepo/parts/Datasheets/AOA0000CE2.pdf; ComponentLink1Description: Datasheet; Operating Temperature: -55C to +155C; Category: Resistor; Type: RES SMD; Composition: TKF; Manufacturer 2: ROHM; Manufacturer Part Number 2: MCR03EZPFX1212; Manufacturer 3: SET; Manufacturer Part Number 3: RMCF1/1612.1K1%TR; Supplier 1: Digi-Key; Supplier Part Number 1: P12.1KHCT-ND; Supplier 2: Digi-Key; Supplier Part Number 2: RHM12.1KHCT-ND; Supplier 3: SET; Supplier Part Number 3: RMCF1/1612.1K1%TR; Quantity Override: 1
R2 = RES1368: as R10 on sheet UNG_8088_EVB_LAN9252-SPI_Copper; MCHP-ID: RES1368; Revision: 1; Status: Production; ComponentLink1URL: https://chn-vm-apps.microchip.com/mchprepo/parts/Datasheets/ENG_DS_1773200_H.pdf; ComponentLink1Description: Datasheet; Operating Temperature: -55C to +155C; Category: Resistor; Type: RES SMD; Composition: TF; Supplier 1: Digi-Key; Supplier Part Number 1: A102203CT-ND; Quantity Override: 1
R25 = RSMT0001: as R8 on sheet UNG_8088_EVB_LAN9252-SPI_Copper; MCHP-ID: RSMT0001; Revision: 2; Status: Production; ComponentLink1URL: https://chn-vm-apps.microchip.com/mchprepo/parts/Datasheets/nrc.pdf; ComponentLink1Description: Datasheet; Operating Temperature: -55C to +155C; Category: Resistor; Type: RES SMD; Composition: TKF; Manufacturer 2: Panasonic; Manufacturer Part Number 2: ERJ-3GSY0R00V; Manufacturer 3: Panasonic; Manufacturer Part Number 3: ERJ-3GEY0R00V; Manufacturer 4: Stackpole Electronics Inc; Manufacturer Part Number 4: RMCF0603ZT0R00; Manufacturer 5: Vishay; Manufacturer Part Number 5: CRCW06030000Z0EA; Manufacturer 6: Stackpole Electronics Inc; Manufacturer Part Number 6: RMCF 1/16 0 R; Manufacturer 7: Yageo; Manufacturer Part Number 7: RC0603JR-070RL; Manufacturer 8: KOA Speer; Manufacturer Part Number 8: RK73Z1JTTP; Manufacturer 9: ROHM; Manufacturer Part Number 9: MCR03EZPJ000; Supplier 1: NIC Components; Supplier Part Number 1: NRC06Z0TRF; Supplier 2: Digi-Key; Supplier Part Number 2: P0.0GTR-ND; Supplier 3: Digi-Key; Supplier Part Number 3: RMCF0603ZT0R00TR-ND; Supplier 4: Digi-Key; Supplier Part Number 4: RMCF0603ZT0R00CT-ND; Supplier 5: Digi-Key; Supplier Part Number 5: 541-0.0GCT-ND; Supplier 6: Digi-Key; Supplier Part Number 6: RMCF1/160RTR-ND; Supplier 7: Digi-Key; Supplier Part Number 7: 311-0.0GRCT-ND; Supplier 8: KOA Speer; Supplier Part Number 8: RK73Z1JTTP; Supplier 9: Digi-Key; Supplier Part Number 9: RHM0.0GCT-ND; Quantity Override: 1
SW1 = Switch TACT 4 Pin PTS810: SWITCH TACTILE SPST-NO 0.05A 16V PTS810 4.2 x 3.2 mm; Manufacturer: C&K Components; Manufacturer Part Number: PTS810 SJM 250 SMTR LFS; Current: 50mA; Switch Function: Off-Mom; Contact Rating @ Voltage: 0.05A @ 16VDC; Actuator Type: Standard; Actuator Height off PCB, from Pins: 2.50mm; Actuator Orientation: Top Actuated; Outline: 4.20mm x 3.20mm; Illumination: Non-Illuminated; Operating Force: 160gf; Switch Travel: 0.15mm; Mechanical Life: 150,000 Cycles; Decription_: Switch, Tactile, SPST, 50mA, 16VDC, J-lead, 4.2 x 3.2 mm, PTS810, NO; Revision: 0; ComponentLink1URL: https://chn-vm-apps.microchip.com/mchprepo/parts/Datasheets/32997.pdf; ComponentLink1Description: Datasheet; Category: Switch; Supplier 1: Digi-Key; RoHS: RoHS Compliant; Stock 1: 21876; Pricing 1: 1=0.28, 10=0.268, 25=0.2588, 50=0.2494, 100=0.2356, 250=0.22176, 500=0.21252, 1000=0.1617 (USD); Packaging: Cut Tape (CT); Circuit: SPST-NO; Mounting Type: Surface Mount; Termination Style: J Lead; Illumination Voltage (Nominal): -; Illumination Type, Color: -; Ingress Protection: -; Features: -; Actuator Material: -; Operating Temperature: -40°C ~ 85°C; ComponentLink2URL: http://www.ck-components.com/80183/pts810_4mar13.pdf/; ComponentLink2Description: http://www.ck-components.com/80183/pts810_4mar13.pdf/; Supplier Part Number 1: CKN10502CT-ND
TP1 TP4 = TEST PAD TH 51X36: Manufacturer Part Number: none; Description_: TEST Pad, PIN sized, 51pad, 36 FHS; Manufacturer: none; Category: Non BOM Item; Type: Male; Mounting Type: Through Hole; Supplier 1: none; Supplier Part Number 1: none
U1 = LAN9252_QFN64: IC, 2/3-Port EtherCAT® Slave Controller, QFN64; Manufacturer Part Number 1: LAN9252x/ML; Manufacturer 1: Microchip; Populated: Yes; Owner: Manikandan; Supplier Part Number 1: LAN9252I/ML-ND; Supplier 1: Digikey; Description_: IC, 2/3-Port EtherCAT® Slave Controller, QFN64; RoHS: Yes; Package: QFN64-9X9x1; Document Link: http://ww1.microchip.com/downloads/en/DeviceDoc/00001909A.pdf; Status: New
Y1 = XTAL 25MHz HC49US: Crystal 25MHz HC49/US; Manufacturer: Murata Electronics North America; Frequency Stability: ±30ppm; Load Capacitance: 6pF; Operating Mode: Fundamental; Revision: A; Supplier 1: Mouser; RoHS: RoHS Compliant; Category: Crystals and Oscillators; Stock 1: 4385; Pricing 1: 1=0.52, 10=0.434, 50=0.3894, 100=0.3465, 500=0.33, 1000=0.2772 (USD); Packaging: Cut Tape (CT); Type: MHz Crystal; Frequency Tolerance: ±30ppm; Operating Temperature: -30°C ~ 85°C; Ratings: -; Mounting Type: Surface Mount; Package / Case: HC49/US

## Sheet UNG_8088_EVB_LAN9252-SPI_LAN9252-2.SchDoc
size 416 x 264 mm; Revision: A0; SheetNumber: 4; SheetTotal: 4; PageSetup: Record=PageOptions|CenterHorizontal=True|CenterVertical=True|PrintScale=1.02|XCorrection=1.00|YCorrection=1.00|PrintKind=0|BorderSize=5000000|LeftOffset=0|BottomOffset=0|Orientation=2|PaperLength=1000|PaperWidth=1000|Scale=100|PaperSource=15|PrintQuality=-3|MediaType=1|DitherType=10|PrintScaleMode=1|PaperKind=11 x 17|PaperIndex=119; SheetTitle: Change Log; PageTitle: LAN9252-2; ProjName: JUTLAND; DesignDescription: EVB_LAN9252-SPI; Designer: Manikandan; PartNumber: UNG_8088; DocumentFullPathAndName: //depot_np_hweng_boards/ung_hweng/UNG_8088_FDB_LAN9252-ADD-ON-forF28379D/
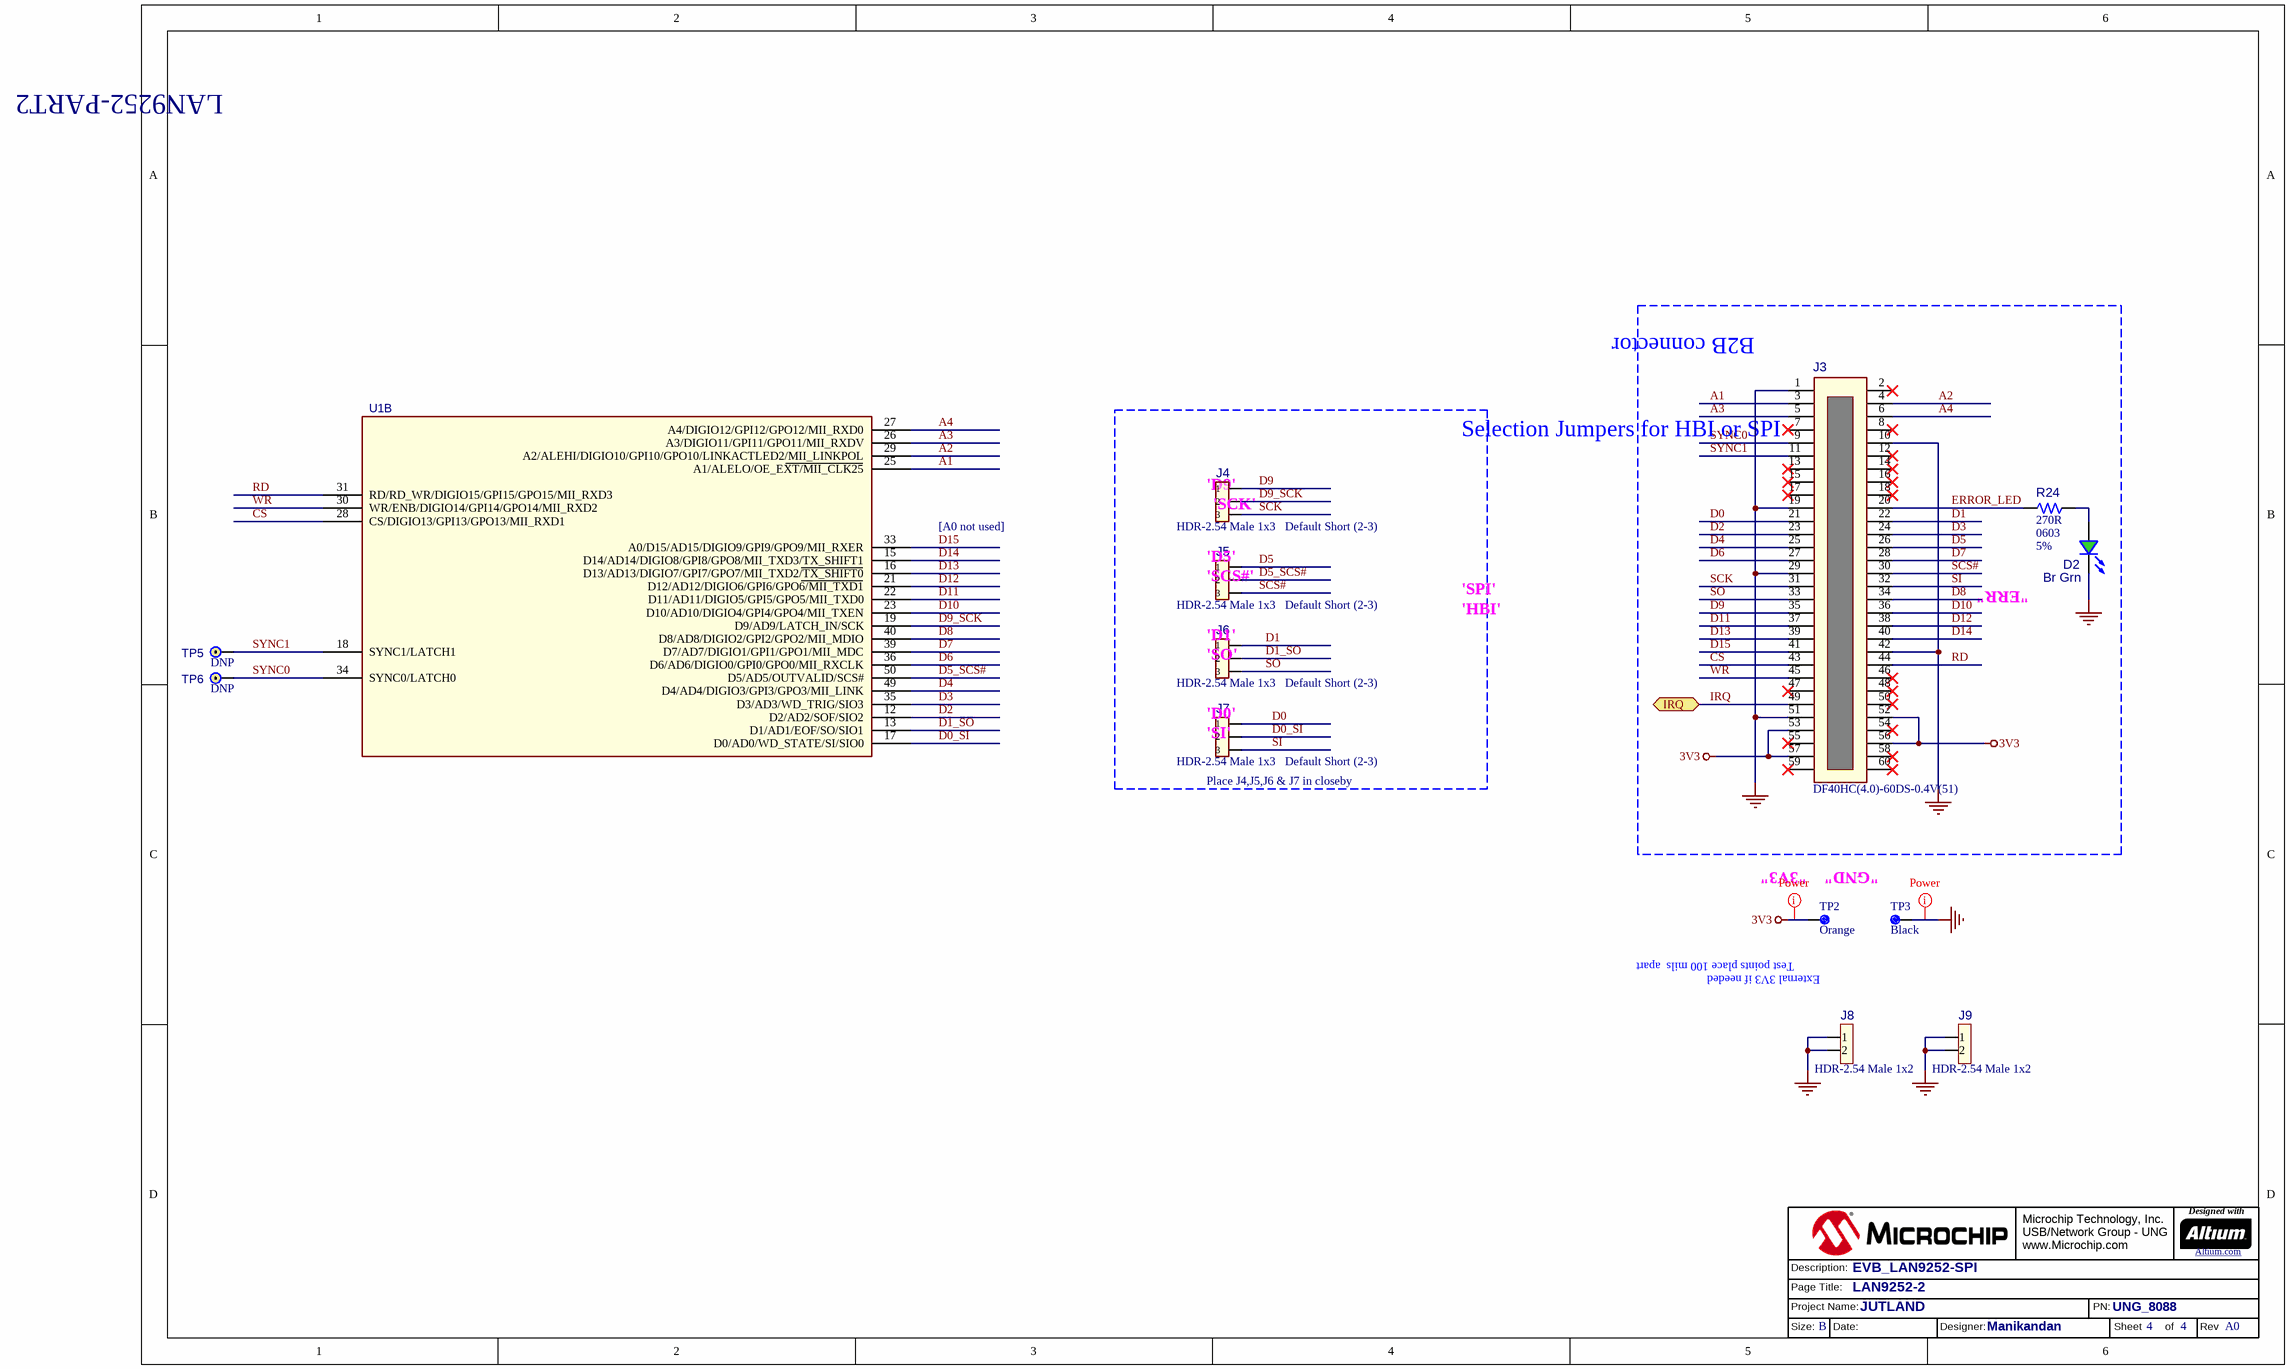
[diagram p2: UNG_8088_EVB_LAN9252-SPI_LAN9252-2.SchDoc]

### Parts
(Parts that share a designator on the sheet are numbered #1, #2 ... from top to bottom, then left to right.)
?#3  (no value)  (graphical)
D2  value Br Grn  [LED_0603_GREEN]  (hidden comment: LED, Bright Green, 0603)
J3  value DF40HC(4.0)-60DS-0.4V(51)  [CONN_DF40HC(4.0)-60DS-0.4V(51)]  (hidden comment: CONN DF40)
J4  value HDR-2.54 Male 1x3  [HDR_M_2.54_1x3]  (hidden comment: Header 1x3)
J5  value HDR-2.54 Male 1x3  [HDR_M_2.54_1x3]  (hidden comment: Header 1x3)
J6  value HDR-2.54 Male 1x3  [HDR_M_2.54_1x3]  (hidden comment: Header 1x3)
J7  value HDR-2.54 Male 1x3  [HDR_M_2.54_1x3]  (hidden comment: Header 1x3)
J8  value HDR-2.54 Male 1x2  [HDR_M_2.54_1x2]  (hidden comment: Header 1x2)
J9  value HDR-2.54 Male 1x2  [HDR_M_2.54_1x2]  (hidden comment: Header 1x2)
R24  value 270R  Package: 0603  Tolerance: 5%  [RES_C_0603]  (hidden comment: Resistor)
TP2  Color: Orange  [CON_TP_TH_V_ORANGE_KEC_5003]  (hidden comment: Mini Orange)
TP3  Color: Black  [CON_TP_TH_V_BLACK_KEC_5001]  (hidden comment: Mini Black)
TP5  Populated: DNP  [TP_PAD51D36]  (hidden comment: Jumper)  (no BOM)
TP6  Populated: DNP  [TP_PAD51D36]  (hidden comment: Jumper)  (no BOM)
U1  (no value)  [QFN-64_9x9_EP6SQ]  (part B of 2)

### Blocks framed on the sheet
B2B connector: D2 J3 R24
Selection Jumpers for HBI or SPI: J4-J7

### Ports
IRQ (bidir)

### Nets
3V3: J3.52(P52) J3.53(P53) J3.56(P56) J3.57(P57) TP2.1
GND: D2.2(K) J3.1(P1) J3.10(P10) J3.19(P19) J3.29(P29) J3.42(P42) J3.51(P51) J8.1 J8.2 J9.1 J9.2 TP3.1
A1: J3.3(P3) U1.25(A1/ALELO/OE_EXT/MII_CLK25)
A2: J3.4(P4) U1.29(A2/ALEHI/DIGIO10/GPI10/GPO10/LINKACTLED2/MII_LINKPOL)
A3: J3.5(P5) U1.26(A3/DIGIO11/GPI11/GPO11/MII_RXDV)
A4: J3.6(P6) U1.27(A4/DIGIO12/GPI12/GPO12/MII_RXD0)
CS: J3.43(P43) U1.28(CS/DIGIO13/GPI13/GPO13/MII_RXD1)
D0: J3.21(P21) J7.1
D0_SI: J7.2 U1.17(D0/AD0/WD_STATE/SI/SIO0)
D1: J3.22(P22) J6.1
D1_SO: J6.2 U1.13(D1/AD1/EOF/SO/SIO1)
D2: J3.23(P23) U1.12(D2/AD2/SOF/SIO2)
D3: J3.24(P24) U1.35(D3/AD3/WD_TRIG/SIO3)
D4: J3.25(P25) U1.49(D4/AD4/DIGIO3/GPI3/GPO3/MII_LINK)
D5: J3.26(P26) J5.1
D5_SCS#: J5.2 U1.50(D5/AD5/OUTVALID/SCS#)
D6: J3.27(P27) U1.36(D6/AD6/DIGIO0/GPI0/GPO0/MII_RXCLK)
D7: J3.28(P28) U1.39(D7/AD7/DIGIO1/GPI1/GPO1/MII_MDC)
D8: J3.34(P34) U1.40(D8/AD8/DIGIO2/GPI2/GPO2/MII_MDIO)
D9: J3.35(P35) J4.1
D9_SCK: J4.2 U1.19(D9/AD9/LATCH_IN/SCK)
D10: J3.36(P36) U1.23(D10/AD10/DIGIO4/GPI4/GPO4/MII_TXEN)
D11: J3.37(P37) U1.22(D11/AD11/DIGIO5/GPI5/GPO5/MII_TXD0)
D12: J3.38(P38) U1.21(D12/AD12/DIGIO6/GPI6/GPO6/MII_TXD1)
D13: J3.39(P39) U1.16(D13/AD13/DIGIO7/GPI7/GPO7/MII_TXD2/TX_SHIFT0)
D14: J3.40(P40) U1.15(D14/AD14/DIGIO8/GPI8/GPO8/MII_TXD3/TX_SHIFT1)
D15: J3.41(P41) U1.33(A0/D15/AD15/DIGIO9/GPI9/GPO9/MII_RXER)
ERROR_LED: J3.20(P20) R24.2
IRQ: J3.49(P49) ; port IRQ
RD: J3.44(P44) U1.31(RD/RD_WR/DIGIO15/GPI15/GPO15/MII_RXD3)
SCK: J3.31(P31) J4.3
SCS#: J3.30(P30) J5.3
SI: J3.32(P32) J7.3
SO: J3.33(P33) J6.3
SYNC0: J3.9(P9) TP6.1(P1) U1.34(SYNC0/LATCH0)
SYNC1: J3.11(P11) TP5.1(P1) U1.18(SYNC1/LATCH1)
WR: J3.45(P45) U1.30(WR/ENB/DIGIO14/GPI14/GPO14/MII_RXD2)
NetD2_1: D2.1(A) R24.1

Not connected (* = marked no-connect by the designer): J3 2(P2)* 7(P7)* 8(P8)* 12(P12)* 13(P13)* 14(P14)* 15(P15)* 16(P16)* 17(P17)* 18(P18)* 46(P46)* 47(P47)* 48(P48)* 50(P50)* 54(P54)* 55(P55)* 58(P58)* 59(P59)* 60(P60)*

### Layout directives
mark named Power: 3V3, GND

### Notes on the sheet
- LAN9252-PART2
- [A0 not used]
- (near J4) 'D9'
- (near J4) 'SCK'
- Default Short (2-3)
- (near J5) 'D5'
- (near J5) 'SCS#'
- 'SPI'
- (near D2) "ERR"
- (near J6) 'D1'
- (near J6) 'SO'
- 'HBI'
- (near J7) 'D0'
- (near J7) 'SI'
- (near J7) Place J4,J5,J6 & J7 in closeby
- (near TP2) "3V3"
- (near TP3) "GND"
- Test points place 100 mils  apart
- External 3V3 if needed
- Microchip Technology, Inc.
  USB/Network Group - UNG
  www.Microchip.com
- Designed with
- Altium.com <http://go.altium.com/MicrochipLandingPage_Evaluation.html>
- Page Title:
- Project Name:
- Description:
- PN:
- Size:
- B
- Date:
- Designer:
- Sheet
- of
- Rev

### Library data of the parts
?#3 = Title Block B_UNG1_Altium
D2 = LED, Bright Green, 0603: as D1 on sheet UNG_8088_EVB_LAN9252-SPI_Copper; Revision: -; Description_: LED, Bright Green, 0603; Package: 0603 (1608 Metric); ComponentLink1URL: http://optoelectronics.liteon.com/upload/download/DS22-2000-228/S_110_LTST-C191KGKT.pdf; ComponentLink1Description: Datasheet; Category: Diode; Mounting Type: Surface Mount; Supplier 1: Digi-Key; Supplier Part Number 1: 160-1446-6-ND
J3 = CONN RCPT 60P 4MM DF40 HRS: Manufacturer 1: Hirose Electric Co Ltd; Owner: Manikandan; Populated: YES; Description_: CONN RCPT 60P 4MM DF40 HRS; ComponentLink1URL: http://nyusperforce.smsc.com//depot_np_hweng_boards/altium_libraries/datasheets/Hirose\DF40HC(4.0)-60DS-0.4V(51).pdf; ComponentLink1Description: Datasheet; Package: 60pin 2 Row; Type: Connector; Category: Interconnects; Manufacturer Part Number 1: DF40HC(4.0)-60DS-0.4V(51); Supplier 1: Digi-Key; Supplier Part Number 1: H11918CT-ND
J4-J7 = CON0465: Manufacturer 1: Samtec; Manufacturer Part Number 1: TSW-103-07-T-S; Description_: CON HDR-2.54 Male 1x3 Tin 5.84MH TH VERT; Populated: Yes; MCHP-ID: CON0465; Revision: 1; Status: Production; ComponentLink1URL: https://chn-vm-apps.microchip.com/mchprepo/parts/Datasheets/TSW-XXX-XX-XXX-X-XX-XXX-MKT.pdf; ComponentLink1Description: Datasheet; Type: Header 2.54mm; Category: Connector; Supplier 1: Digi-Key; Supplier Part Number 1: SAM1035-03-ND; Quantity Override: 1
J8 J9 = CON1312: Manufacturer 1: Sullins Connector Solutions; Manufacturer Part Number 1: PREC002SAAN-RC; Description_: CON HDR-2.54 Male 1x2 Tin 5.84MH TH VERT; Owner: Randolph Sobrepena; Populated: YES; MCHP-ID: CON1312; Revision: 2; Status: Production; ComponentLink1URL: https://chn-vm-apps.microchip.com/mchprepo/parts/Datasheets/z RzCzzzSzzN-RC, ST,11635-B.pdf; ComponentLink1Description: Datasheet; Type: Header 2.54mm; Category: Connector; Supplier 1: Digi-Key; Supplier Part Number 1: S1012EC-02-ND; Quantity Override: 1
R24 = RES1150: as R9 on sheet UNG_8088_EVB_LAN9252-SPI_Copper; MCHP-ID: RES1150; Revision: 0; Status: MCL Design; ComponentLink1URL: https://chn-vm-apps.microchip.com/mchprepo/parts/Datasheets/AOA0000CE1.pdf; ComponentLink1Description: Datasheet; Operating Temperature: -55C to +155C; Category: Resistor; Type: RES SMD; Composition: TKF; Supplier 1: Digi-Key; Supplier Part Number 1: P270GCT-ND; Quantity Override: 1
TP2 = TP 66R42 ORN: TEST POINT PC MINI .040"D ORANGE; Manufacturer 1: Keystone Electronics; Manufacturer Part Number 1: 5003; Populated: Yes; Supplier 1: Digi-Key; RoHS: RoHS Compliant; Category: Test and Measurement; Stock 1: 88091; Pricing 1: 1=0.35, 10=0.327, 50=0.238, 100=0.2286, 250=0.20528, 500=0.19594, 1000=0.16328, 2500=0.14928, 5000=0.13995 (USD); Packaging: Bulk; Type: PC Test Point, Miniature; Mounting Type: 0.040" (1.02mm) Hole Diameter; Description_: TEST POINT PC MINI .040"D ORANGE; ComponentLink1URL: http://www.keyelco.com/product-pdf.cfm?p=1312; ComponentLink1Description: http://www.keyelco.com/product-pdf.cfm?p=1312; Supplier Part Number 1: 5003K-ND
TP3 = TP 66R42 BLK: TEST POINT PC MINI .040"D BLACK; Manufacturer 1: Keystone Electronics; Manufacturer Part Number 1: 5001; Populated: Yes; Supplier 1: Digi-Key; RoHS: RoHS Compliant; Category: Test and Measurement; Stock 1: 88091; Pricing 1: 1=0.35, 10=0.327, 50=0.238, 100=0.2286, 250=0.20528, 500=0.19594, 1000=0.16328, 2500=0.14928, 5000=0.13995 (USD); Packaging: Bulk; Type: PC Test Point, Miniature; Terminal: 0.010" x 0.020" (0.25mm x 0.51mm) Phosphor Bronze Wire, Silver Plated; Description_: TEST POINT PC MINI .040"D BLACK; ComponentLink1URL: http://www.keyelco.com/product-pdf.cfm?p=1310; ComponentLink1Description: http://www.keyelco.com/product-pdf.cfm?p=1310; Supplier Part Number 1: 5001K-ND
TP5 TP6 = TEST PAD TH 51X36: as TP1 on sheet UNG_8088_EVB_LAN9252-SPI_LAN9252-1; Manufacturer: none; Category: Non BOM Item; Type: Male; Mounting Type: Through Hole; Supplier 1: none; Supplier Part Number 1: none
U1 = LAN9252_QFN64: as U1 on sheet UNG_8088_EVB_LAN9252-SPI_LAN9252-1; Supplier Part Number 1: LAN9252I/ML-ND; Supplier 1: Digikey; Description_: IC, 2/3-Port EtherCAT® Slave Controller, QFN64; RoHS: Yes; Package: QFN64-9X9x1; Document Link: http://ww1.microchip.com/downloads/en/DeviceDoc/00001909A.pdf; Status: New

## Nets that join several sheets
3V3: UNG_8088_EVB_LAN9252-SPI_Copper (6 pins), UNG_8088_EVB_LAN9252-SPI_LAN9252-1 (17 pins), UNG_8088_EVB_LAN9252-SPI_LAN9252-2 (5 pins)
GND: UNG_8088_EVB_LAN9252-SPI_Copper (19 pins), UNG_8088_EVB_LAN9252-SPI_LAN9252-1 (31 pins), UNG_8088_EVB_LAN9252-SPI_LAN9252-2 (12 pins)
VDD33TXRX1: UNG_8088_EVB_LAN9252-SPI_Copper (5 pins), UNG_8088_EVB_LAN9252-SPI_LAN9252-1 (C1.2 C2.2 FB1.2 U1.51)
VDD33TXRX2: UNG_8088_EVB_LAN9252-SPI_Copper (5 pins), UNG_8088_EVB_LAN9252-SPI_LAN9252-1 (C17.2 C18.2 FB2.2 U1.64)
GPIO0: UNG_8088_EVB_LAN9252-SPI_Copper (R3.2 R11.2), UNG_8088_EVB_LAN9252-SPI_LAN9252-1 (U1.48)
GPIO1: UNG_8088_EVB_LAN9252-SPI_Copper (R12.2 R14.2), UNG_8088_EVB_LAN9252-SPI_LAN9252-1 (U1.46)
IRQ: UNG_8088_EVB_LAN9252-SPI_LAN9252-1 (TP4.1 U1.44), UNG_8088_EVB_LAN9252-SPI_LAN9252-2 (J3.49)
NetC23_2: UNG_8088_EVB_LAN9252-SPI_Copper (C23.2 J1.1 R4.1), UNG_8088_EVB_LAN9252-SPI_LAN9252-1 (U1.53)
NetC24_2: UNG_8088_EVB_LAN9252-SPI_Copper (C24.2 J1.2 R5.1), UNG_8088_EVB_LAN9252-SPI_LAN9252-1 (U1.52)
NetC25_2: UNG_8088_EVB_LAN9252-SPI_Copper (C25.2 J1.3 R6.1), UNG_8088_EVB_LAN9252-SPI_LAN9252-1 (U1.55)
NetC26_2: UNG_8088_EVB_LAN9252-SPI_Copper (C26.2 J1.6 R7.1), UNG_8088_EVB_LAN9252-SPI_LAN9252-1 (U1.54)
NetC29_2: UNG_8088_EVB_LAN9252-SPI_Copper (C29.2 J2.1 R15.1), UNG_8088_EVB_LAN9252-SPI_LAN9252-1 (U1.62)
NetC30_2: UNG_8088_EVB_LAN9252-SPI_Copper (C30.2 J2.2 R16.1), UNG_8088_EVB_LAN9252-SPI_LAN9252-1 (U1.63)
NetC31_2: UNG_8088_EVB_LAN9252-SPI_Copper (C31.2 J2.3 R17.1), UNG_8088_EVB_LAN9252-SPI_LAN9252-1 (U1.60)
NetC32_2: UNG_8088_EVB_LAN9252-SPI_Copper (C32.2 J2.6 R18.1), UNG_8088_EVB_LAN9252-SPI_LAN9252-1 (U1.61)
NetR9_1: UNG_8088_EVB_LAN9252-SPI_Copper (R9.1 R10.1), UNG_8088_EVB_LAN9252-SPI_LAN9252-1 (U1.45)
NetR19_1: UNG_8088_EVB_LAN9252-SPI_Copper (R19.1 U2.6), UNG_8088_EVB_LAN9252-SPI_LAN9252-1 (U1.43)
NetR20_1: UNG_8088_EVB_LAN9252-SPI_Copper (R20.1 U2.5), UNG_8088_EVB_LAN9252-SPI_LAN9252-1 (U1.42)